# EAGLE board NeoPixel_HD_rev0 (EAGLE 7.2.0), part 1 of 2
REV: B
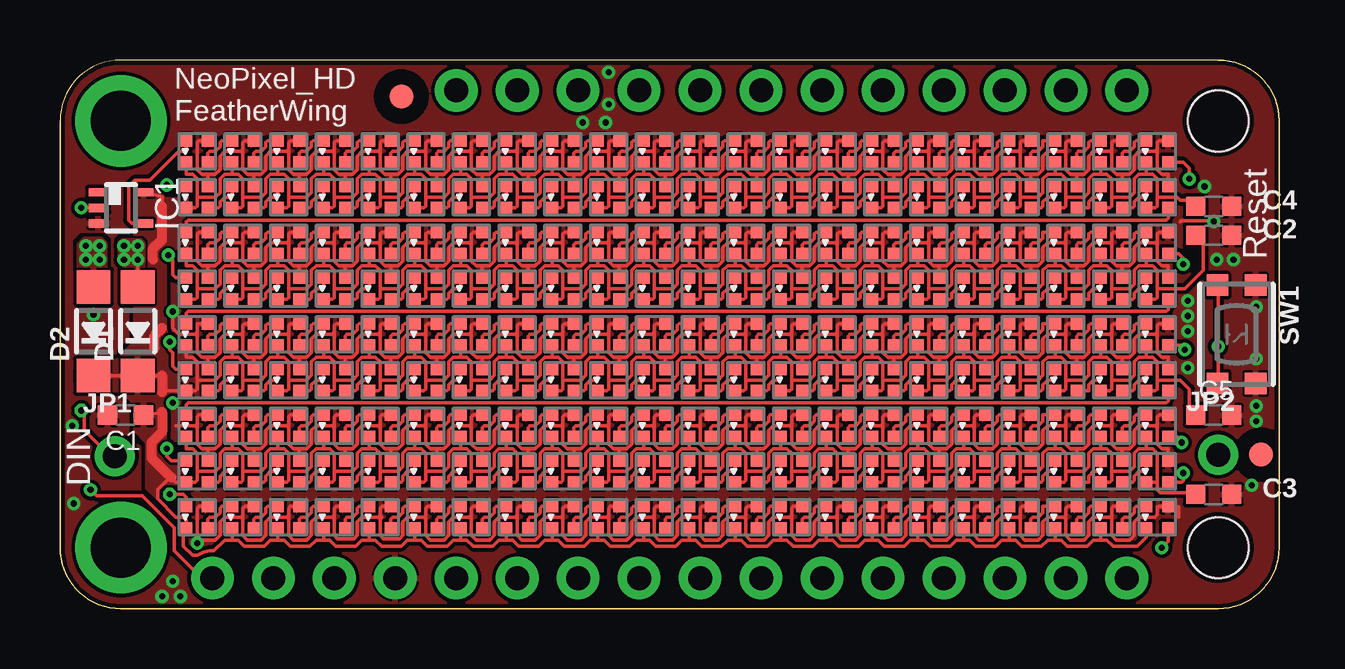
[diagram p2: board, top side]
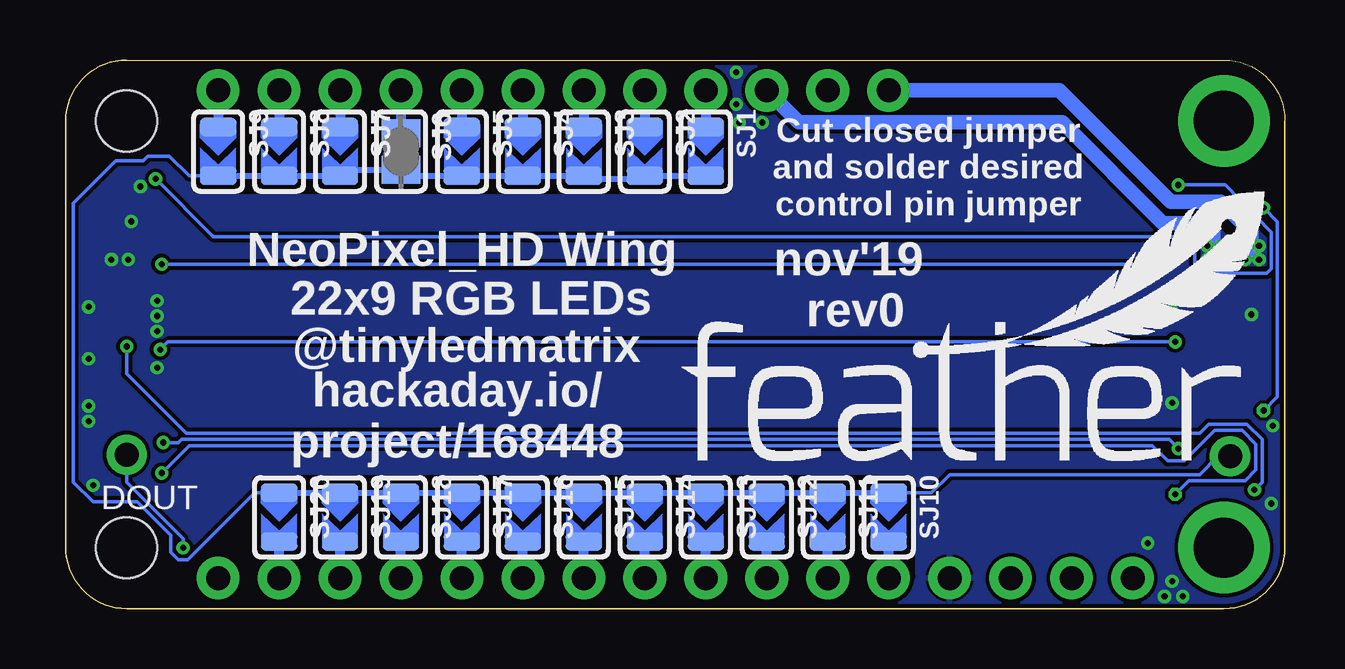
[diagram p3: board, bottom side, seen from below]

Size 50.8 x 22.86 mm. Coordinates in mm from the lower left corner, seen from the top.
Outline: 48.26,22.86 arc-90 50.8,20.32 50.8,2.54 arc-90 48.26,0 2.54,0 arc-90 0,2.54 0,20.32
Copper layers (1*16): Top 0.035mm / dielectric 1.5mm / Bottom 0.035mm
Design rules "aisler_2_layer *": minimum track width 0.1mm, minimum drill 0.2mm, track to track 0.1mm, track to pad 0.1mm, pad to pad 0.1mm, via to via 0.1mm, smd to smd 0.1mm, copper to edge 0.2mm, drill to drill 0.21mm, minimum pad ring 0.25mm, minimum via ring 0.15mm, stop-mask expansion 0mil, vias tented up to drill 10mil, thermal gap 0.1mm
bRestrict: area 17.5,3.2 to 18,3.3; 6 lines

## Footprints (pad centres in the part's own frame; a part is rotated, then mirrored left to right if it is on the bottom)
C0603-VISHAY = smd 0.8 x 0.8: 1 -0.75,0; 2 0.75,0
SOD-123 = smd 1.4 x 1.4: A 1.85,0; C -1.85,0
FIDUCIAL_1MM = smd 1 x 1: 1 0,0
DCK_R-PDSO-G5 = smd 0.35 x 0.8: 1 -0.65,-0.95; 2 0,-0.95; 3 0.65,-0.95; 4 0.65,0.95; 5 -0.65,0.95
1X01_ROUND = drill 1 pad 1.676: 1 0,0
LED1515 = smd 0.5 x 0.5: DIN 0.45,0.45; DOUT -0.45,-0.45; GND 0.45,-0.45; VDD -0.45,0.45
FEATHERWING = drill 1 pad 1.778: 1 6.35,1.27; 2 8.89,1.27; 3 11.43,1.27; 4 13.97,1.27; 5 16.51,1.27; 6 19.05,1.27; 7 21.59,1.27; 8 24.13,1.27; 9 26.67,1.27; 10 29.21,1.27; 11 31.75,1.27; 12 34.29,1.27; 13 36.83,1.27; 14 39.37,1.27; 15 41.91,1.27; 16 44.45,1.27; 17 44.45,21.59; 18 41.91,21.59; 19 39.37,21.59; 20 36.83,21.59; 21 34.29,21.59; 22 31.75,21.59; 23 29.21,21.59; 24 26.67,21.59; 25 24.13,21.59; 26 21.59,21.59; 27 19.05,21.59; 28 16.51,21.59 | drill 2.5 pad 3.81: P$1 2.54,20.32; P$2 2.54,2.54 | hole 2.54: 48.26,20.32; 48.26,2.54
SOLDERJUMPER_ARROW_NOPASTE = smd 0.762 x 1.524: 1 -1.016,0; 2 1.016,0
SOLDERJUMPER_CLOSEDWIRE = smd 1.168 x 1.6: 1 -0.762,0; 2 0.762,0 | smd 0.635 x 0.203: WIRE 0,0
BTN_KMR2_4.6X2.8 = smd 0.9 x 0.9: A 2.05,0.8; A' -2.05,0.8; B 2.05,-0.8; B' -2.05,-0.8

## Placement (x,y rotation side)
C1  10uF 10V X7R  [C0603-VISHAY]  2.73,8.06 180 top
C2  10uF  [C0603-VISHAY]  48.07,15.56 0 top
C3  10uF  [C0603-VISHAY]  48.07,4.76 0 top
C4  10uF  [C0603-VISHAY]  48.07,16.76 0 top
C5  10uF  [C0603-VISHAY]  48.07,8.06 0 top
D1  MBR120  [SOD-123]  3.24,11.56 90 top
D2  MBR120  [SOD-123]  1.4,11.56 90 top
FID1  FIDUCIAL""  [FIDUCIAL_1MM]  14.22,21.34 0 top
FID2  FIDUCIAL""  [FIDUCIAL_1MM]  50.04,6.41 0 top
IC1  SN74LV1T34  [DCK_R-PDSO-G5]  2.54,16.7 270 top
JP1  [1X01_ROUND]  2.29,6.35 0 top
JP2  [1X01_ROUND]  48.26,6.41 0 top
LED1  WS2812B1515  [LED1515]  5.71,19.05 90 top
LED2  WS2812B1515  [LED1515]  7.62,19.05 90 top
LED3  WS2812B1515  [LED1515]  9.53,19.05 90 top
LED4  WS2812B1515  [LED1515]  11.43,19.05 90 top
LED5  WS2812B1515  [LED1515]  13.34,19.05 90 top
LED6  WS2812B1515  [LED1515]  15.24,19.05 90 top
LED7  WS2812B1515  [LED1515]  17.14,19.05 90 top
LED8  WS2812B1515  [LED1515]  19.05,19.05 90 top
LED9  WS2812B1515  [LED1515]  20.95,19.05 90 top
LED10  WS2812B1515  [LED1515]  22.86,19.05 90 top
LED11  WS2812B1515  [LED1515]  24.77,19.05 90 top
LED12  WS2812B1515  [LED1515]  26.67,19.05 90 top
LED13  WS2812B1515  [LED1515]  28.57,19.05 90 top
LED14  WS2812B1515  [LED1515]  30.48,19.05 90 top
LED15  WS2812B1515  [LED1515]  32.38,19.05 90 top
LED16  WS2812B1515  [LED1515]  34.29,19.05 90 top
LED17  WS2812B1515  [LED1515]  36.2,19.05 90 top
LED18  WS2812B1515  [LED1515]  38.1,19.05 90 top
LED19  WS2812B1515  [LED1515]  40.01,19.05 90 top
LED20  WS2812B1515  [LED1515]  41.91,19.05 90 top
LED21  WS2812B1515  [LED1515]  43.81,19.05 90 top
LED22  WS2812B1515  [LED1515]  45.72,19.05 90 top
LED23  WS2812B1515  [LED1515]  5.71,17.14 90 top
LED24  WS2812B1515  [LED1515]  7.62,17.14 90 top
LED25  WS2812B1515  [LED1515]  9.53,17.14 90 top
LED26  WS2812B1515  [LED1515]  11.43,17.14 90 top
LED27  WS2812B1515  [LED1515]  13.34,17.14 90 top
LED28  WS2812B1515  [LED1515]  15.24,17.14 90 top
LED29  WS2812B1515  [LED1515]  17.14,17.14 90 top
LED30  WS2812B1515  [LED1515]  19.05,17.14 90 top
LED31  WS2812B1515  [LED1515]  20.95,17.14 90 top
LED32  WS2812B1515  [LED1515]  22.86,17.14 90 top
LED33  WS2812B1515  [LED1515]  24.77,17.14 90 top
LED34  WS2812B1515  [LED1515]  26.67,17.14 90 top
LED35  WS2812B1515  [LED1515]  28.57,17.14 90 top
LED36  WS2812B1515  [LED1515]  30.48,17.14 90 top
LED37  WS2812B1515  [LED1515]  32.38,17.14 90 top
LED38  WS2812B1515  [LED1515]  34.29,17.14 90 top
LED39  WS2812B1515  [LED1515]  36.2,17.14 90 top
LED40  WS2812B1515  [LED1515]  38.1,17.14 90 top
LED41  WS2812B1515  [LED1515]  40.01,17.14 90 top
LED42  WS2812B1515  [LED1515]  41.91,17.14 90 top
LED43  WS2812B1515  [LED1515]  43.81,17.14 90 top
LED44  WS2812B1515  [LED1515]  45.72,17.14 90 top
LED45  WS2812B1515  [LED1515]  5.71,15.24 90 top
LED46  WS2812B1515  [LED1515]  7.62,15.24 90 top
LED47  WS2812B1515  [LED1515]  9.53,15.24 90 top
LED48  WS2812B1515  [LED1515]  11.43,15.24 90 top
LED49  WS2812B1515  [LED1515]  13.34,15.24 90 top
LED50  WS2812B1515  [LED1515]  15.24,15.24 90 top
LED51  WS2812B1515  [LED1515]  17.14,15.24 90 top
LED52  WS2812B1515  [LED1515]  19.05,15.24 90 top
LED53  WS2812B1515  [LED1515]  20.95,15.24 90 top
LED54  WS2812B1515  [LED1515]  22.86,15.24 90 top
LED55  WS2812B1515  [LED1515]  24.77,15.24 90 top
LED56  WS2812B1515  [LED1515]  26.67,15.24 90 top
LED57  WS2812B1515  [LED1515]  28.57,15.24 90 top
LED58  WS2812B1515  [LED1515]  30.48,15.24 90 top
LED59  WS2812B1515  [LED1515]  32.38,15.24 90 top
LED60  WS2812B1515  [LED1515]  34.29,15.24 90 top
LED61  WS2812B1515  [LED1515]  36.2,15.24 90 top
LED62  WS2812B1515  [LED1515]  38.1,15.24 90 top
LED63  WS2812B1515  [LED1515]  40.01,15.24 90 top
LED64  WS2812B1515  [LED1515]  41.91,15.24 90 top
LED65  WS2812B1515  [LED1515]  43.81,15.24 90 top
LED66  WS2812B1515  [LED1515]  45.72,15.24 90 top
LED67  WS2812B1515  [LED1515]  5.71,13.34 90 top
LED68  WS2812B1515  [LED1515]  7.62,13.34 90 top
LED69  WS2812B1515  [LED1515]  9.53,13.34 90 top
LED70  WS2812B1515  [LED1515]  11.43,13.34 90 top
LED71  WS2812B1515  [LED1515]  13.34,13.34 90 top
LED72  WS2812B1515  [LED1515]  15.24,13.34 90 top
LED73  WS2812B1515  [LED1515]  17.14,13.34 90 top
LED74  WS2812B1515  [LED1515]  19.05,13.34 90 top
LED75  WS2812B1515  [LED1515]  20.95,13.34 90 top
LED76  WS2812B1515  [LED1515]  22.86,13.34 90 top
LED77  WS2812B1515  [LED1515]  24.77,13.34 90 top
LED78  WS2812B1515  [LED1515]  26.67,13.34 90 top
LED79  WS2812B1515  [LED1515]  28.57,13.34 90 top
LED80  WS2812B1515  [LED1515]  30.48,13.34 90 top
LED81  WS2812B1515  [LED1515]  32.38,13.34 90 top
LED82  WS2812B1515  [LED1515]  34.29,13.34 90 top
LED83  WS2812B1515  [LED1515]  36.2,13.34 90 top
LED84  WS2812B1515  [LED1515]  38.1,13.34 90 top
LED85  WS2812B1515  [LED1515]  40.01,13.34 90 top
LED86  WS2812B1515  [LED1515]  41.91,13.34 90 top
LED87  WS2812B1515  [LED1515]  43.81,13.34 90 top
LED88  WS2812B1515  [LED1515]  45.72,13.34 90 top
LED89  WS2812B1515  [LED1515]  5.71,11.43 90 top
LED90  WS2812B1515  [LED1515]  7.62,11.43 90 top
LED91  WS2812B1515  [LED1515]  9.53,11.43 90 top
LED92  WS2812B1515  [LED1515]  11.43,11.43 90 top
LED93  WS2812B1515  [LED1515]  13.34,11.43 90 top
LED94  WS2812B1515  [LED1515]  15.24,11.43 90 top
LED95  WS2812B1515  [LED1515]  17.14,11.43 90 top
LED96  WS2812B1515  [LED1515]  19.05,11.43 90 top
LED97  WS2812B1515  [LED1515]  20.95,11.43 90 top
LED98  WS2812B1515  [LED1515]  22.86,11.43 90 top
LED99  WS2812B1515  [LED1515]  24.77,11.43 90 top
LED100  WS2812B1515  [LED1515]  26.67,11.43 90 top
LED101  WS2812B1515  [LED1515]  28.57,11.43 90 top
LED102  WS2812B1515  [LED1515]  30.48,11.43 90 top
LED103  WS2812B1515  [LED1515]  32.38,11.43 90 top
LED104  WS2812B1515  [LED1515]  34.29,11.43 90 top
LED105  WS2812B1515  [LED1515]  36.2,11.43 90 top
LED106  WS2812B1515  [LED1515]  38.1,11.43 90 top
LED107  WS2812B1515  [LED1515]  40.01,11.43 90 top
LED108  WS2812B1515  [LED1515]  41.91,11.43 90 top
LED109  WS2812B1515  [LED1515]  43.81,11.43 90 top
LED110  WS2812B1515  [LED1515]  45.72,11.43 90 top
LED111  WS2812B1515  [LED1515]  5.71,9.53 90 top
LED112  WS2812B1515  [LED1515]  7.62,9.53 90 top
LED113  WS2812B1515  [LED1515]  9.53,9.53 90 top
LED114  WS2812B1515  [LED1515]  11.43,9.53 90 top
LED115  WS2812B1515  [LED1515]  13.34,9.53 90 top
LED116  WS2812B1515  [LED1515]  15.24,9.53 90 top
LED117  WS2812B1515  [LED1515]  17.14,9.53 90 top
LED118  WS2812B1515  [LED1515]  19.05,9.53 90 top
LED119  WS2812B1515  [LED1515]  20.95,9.53 90 top
LED120  WS2812B1515  [LED1515]  22.86,9.53 90 top
LED121  WS2812B1515  [LED1515]  24.77,9.53 90 top
LED122  WS2812B1515  [LED1515]  26.67,9.53 90 top
LED123  WS2812B1515  [LED1515]  28.57,9.53 90 top
LED124  WS2812B1515  [LED1515]  30.48,9.53 90 top
LED125  WS2812B1515  [LED1515]  32.38,9.53 90 top
LED126  WS2812B1515  [LED1515]  34.29,9.53 90 top
LED127  WS2812B1515  [LED1515]  36.2,9.53 90 top
LED128  WS2812B1515  [LED1515]  38.1,9.53 90 top
LED129  WS2812B1515  [LED1515]  40.01,9.53 90 top
LED130  WS2812B1515  [LED1515]  41.91,9.53 90 top
LED131  WS2812B1515  [LED1515]  43.81,9.53 90 top
LED132  WS2812B1515  [LED1515]  45.72,9.53 90 top
LED133  WS2812B1515  [LED1515]  5.71,7.62 90 top
LED134  WS2812B1515  [LED1515]  7.62,7.62 90 top
LED135  WS2812B1515  [LED1515]  9.53,7.62 90 top
LED136  WS2812B1515  [LED1515]  11.43,7.62 90 top
LED137  WS2812B1515  [LED1515]  13.34,7.62 90 top
LED138  WS2812B1515  [LED1515]  15.24,7.62 90 top
LED139  WS2812B1515  [LED1515]  17.14,7.62 90 top
LED140  WS2812B1515  [LED1515]  19.05,7.62 90 top
LED141  WS2812B1515  [LED1515]  20.95,7.62 90 top
LED142  WS2812B1515  [LED1515]  22.86,7.62 90 top
LED143  WS2812B1515  [LED1515]  24.77,7.62 90 top
LED144  WS2812B1515  [LED1515]  26.67,7.62 90 top
LED145  WS2812B1515  [LED1515]  28.57,7.62 90 top
LED146  WS2812B1515  [LED1515]  30.48,7.62 90 top
LED147  WS2812B1515  [LED1515]  32.38,7.62 90 top
LED148  WS2812B1515  [LED1515]  34.29,7.62 90 top
LED149  WS2812B1515  [LED1515]  36.2,7.62 90 top
LED150  WS2812B1515  [LED1515]  38.1,7.62 90 top
LED151  WS2812B1515  [LED1515]  40.01,7.62 90 top
LED152  WS2812B1515  [LED1515]  41.91,7.62 90 top
LED153  WS2812B1515  [LED1515]  43.81,7.62 90 top
LED154  WS2812B1515  [LED1515]  45.72,7.62 90 top
LED155  WS2812B1515  [LED1515]  5.71,5.71 90 top
LED156  WS2812B1515  [LED1515]  7.62,5.71 90 top
LED157  WS2812B1515  [LED1515]  9.53,5.71 90 top
LED158  WS2812B1515  [LED1515]  11.43,5.71 90 top
LED159  WS2812B1515  [LED1515]  13.34,5.71 90 top
LED160  WS2812B1515  [LED1515]  15.24,5.71 90 top
LED161  WS2812B1515  [LED1515]  17.14,5.71 90 top
LED162  WS2812B1515  [LED1515]  19.05,5.71 90 top
LED163  WS2812B1515  [LED1515]  20.95,5.71 90 top
LED164  WS2812B1515  [LED1515]  22.86,5.71 90 top
LED165  WS2812B1515  [LED1515]  24.77,5.71 90 top
LED166  WS2812B1515  [LED1515]  26.67,5.71 90 top
LED167  WS2812B1515  [LED1515]  28.57,5.71 90 top
LED168  WS2812B1515  [LED1515]  30.48,5.71 90 top
LED169  WS2812B1515  [LED1515]  32.38,5.71 90 top
LED170  WS2812B1515  [LED1515]  34.29,5.71 90 top
LED171  WS2812B1515  [LED1515]  36.2,5.71 90 top
LED172  WS2812B1515  [LED1515]  38.1,5.71 90 top
LED173  WS2812B1515  [LED1515]  40.01,5.71 90 top
LED174  WS2812B1515  [LED1515]  41.91,5.71 90 top
LED175  WS2812B1515  [LED1515]  43.81,5.71 90 top
LED176  WS2812B1515  [LED1515]  45.72,5.71 90 top
LED177  WS2812B1515  [LED1515]  5.71,3.81 90 top
LED178  WS2812B1515  [LED1515]  7.62,3.81 90 top
LED179  WS2812B1515  [LED1515]  9.53,3.81 90 top
LED180  WS2812B1515  [LED1515]  11.43,3.81 90 top
LED181  WS2812B1515  [LED1515]  13.34,3.81 90 top
LED182  WS2812B1515  [LED1515]  15.24,3.81 90 top
LED183  WS2812B1515  [LED1515]  17.14,3.81 90 top
LED184  WS2812B1515  [LED1515]  19.05,3.81 90 top
LED185  WS2812B1515  [LED1515]  20.95,3.81 90 top
LED186  WS2812B1515  [LED1515]  22.86,3.81 90 top
LED187  WS2812B1515  [LED1515]  24.77,3.81 90 top
LED188  WS2812B1515  [LED1515]  26.67,3.81 90 top
LED189  WS2812B1515  [LED1515]  28.57,3.81 90 top
LED190  WS2812B1515  [LED1515]  30.48,3.81 90 top
LED191  WS2812B1515  [LED1515]  32.38,3.81 90 top
LED192  WS2812B1515  [LED1515]  34.29,3.81 90 top
LED193  WS2812B1515  [LED1515]  36.2,3.81 90 top
LED194  WS2812B1515  [LED1515]  38.1,3.81 90 top
LED195  WS2812B1515  [LED1515]  40.01,3.81 90 top
LED196  WS2812B1515  [LED1515]  41.91,3.81 90 top
LED197  WS2812B1515  [LED1515]  43.81,3.81 90 top
LED198  WS2812B1515  [LED1515]  45.72,3.81 90 top
MS1  FEATHERWING  [FEATHERWING]  0,0 0 top
SJ1  [SOLDERJUMPER_ARROW_NOPASTE]  24.13,19.05 270 bottom
SJ2  [SOLDERJUMPER_ARROW_NOPASTE]  26.67,19.05 270 bottom
SJ3  [SOLDERJUMPER_ARROW_NOPASTE]  29.21,19.05 270 bottom
SJ4  [SOLDERJUMPER_ARROW_NOPASTE]  31.75,19.05 270 bottom
SJ5  [SOLDERJUMPER_ARROW_NOPASTE]  34.29,19.05 270 bottom
SJ6  [SOLDERJUMPER_CLOSEDWIRE]  36.83,19.05 270 bottom
SJ7  [SOLDERJUMPER_ARROW_NOPASTE]  39.37,19.05 270 bottom
SJ8  [SOLDERJUMPER_ARROW_NOPASTE]  41.91,19.05 270 bottom
SJ9  [SOLDERJUMPER_ARROW_NOPASTE]  44.45,19.05 270 bottom
SJ10  [SOLDERJUMPER_ARROW_NOPASTE]  16.51,3.81 270 bottom
SJ11  [SOLDERJUMPER_ARROW_NOPASTE]  19.05,3.81 270 bottom
SJ12  [SOLDERJUMPER_ARROW_NOPASTE]  21.59,3.81 270 bottom
SJ13  [SOLDERJUMPER_ARROW_NOPASTE]  24.13,3.81 270 bottom
SJ14  [SOLDERJUMPER_ARROW_NOPASTE]  26.67,3.81 270 bottom
SJ15  [SOLDERJUMPER_ARROW_NOPASTE]  29.21,3.81 270 bottom
SJ16  [SOLDERJUMPER_ARROW_NOPASTE]  31.75,3.81 270 bottom
SJ17  [SOLDERJUMPER_ARROW_NOPASTE]  34.29,3.81 270 bottom
SJ18  [SOLDERJUMPER_ARROW_NOPASTE]  36.83,3.81 270 bottom
SJ19  [SOLDERJUMPER_ARROW_NOPASTE]  39.37,3.81 270 bottom
SJ20  [SOLDERJUMPER_ARROW_NOPASTE]  41.91,3.81 270 bottom
SW1  KMR2  [BTN_KMR2_4.6X2.8]  49.02,11.43 270 top
U$3  [FEATHERLOGO]  25.15,6.1 0 bottom

## Tracks (layer width: path | path; a pad name or v marks a point on that pad's centre or on a via)
D6
  Bottom 0.406: MS1.20 SJ6.1
DIN  (via drill 0.25 pad 0.51)
  Top 0.152: IC1.2 v0.89,16.7 | v0.89,8.26 1.02,8.13 1.02,7.43 2.1,6.35 JP1.1
  Bottom 0.152: SJ9.2 45.66,18.03 46.48,18.86 47.37,18.86 47.56,18.67 48.7,18.67 50.48,16.89 50.48,5.27 49.66,4.45 47.82,4.45 46.42,3.05 46.42,2.35 46.1,2.03 45.72,2.03 42.93,4.83 SJ20.1 | JP1.1 2.79,6.35 3.56,5.59 13.97,5.59 14.73,4.83 SJ10.1 | v0.89,8.26 0.32,8.83 0.32,16.13 v0.89,16.7
  Bottom 0.254: SJ10.1 SJ11.1 SJ12.1 SJ13.1 SJ14.1 SJ15.1 SJ16.1 SJ17.1 SJ18.1 SJ19.1 SJ20.1 42.16,4.83 | SJ1.2 SJ2.2 26.29,18.03 26.16,17.91 29.08,17.91 SJ3.2 SJ4.2 SJ5.2 36.58,18.03 SJ6.2 39.12,18.29 SJ7.2 SJ8.2 SJ9.2 43.31,18.03
GND  (via drill 0.25 pad 0.51)
  Top 0.152: LED23.GND 6.17,18.1 | 6.17,18.1 5.91,18.1 5.71,18.29 5.71,19.42 5.79,19.5 LED1.GND | LED24.GND 8.07,18.1 | 8.07,18.1 7.81,18.1 7.62,18.29 7.62,19.05 | 7.62,19.05 6.86,19.05 6.67,18.86 6.67,18.29 6.48,18.1 6.17,18.1 | LED25.GND 9.97,18.1 | 9.97,18.1 9.72,18.1 9.53,18.29 9.53,19.05 | 9.53,19.05 8.76,19.05 8.57,18.86 8.57,18.29 8.38,18.1 8.07,18.1 | LED26.GND 11.88,18.1 | 11.88,18.1 11.62,18.1 11.43,18.29 11.43,19.05 | 11.43,19.05 10.67,19.05 10.48,18.86 10.48,18.29 10.29,18.1 9.97,18.1 | LED27.GND 13.79,18.1 | 13.79,18.1 13.53,18.1 13.34,18.29 13.34,19.05 | 13.34,19.05 12.57,19.05 12.38,18.86 12.38,18.29 12.19,18.1 11.88,18.1 | LED28.GND 15.69,18.1 | 15.69,18.1 15.43,18.1 15.24,18.29 15.24,19.05 | 15.24,19.05 14.48,19.05 14.29,18.86 14.29,18.29 14.1,18.1 13.79,18.1 | LED29.GND 17.59,18.1 | 17.59,18.1 17.34,18.1 17.14,18.29 17.14,19.05 | 17.14,19.05 16.38,19.05 16.19,18.86 16.19,18.29 16,18.1 15.69,18.1 | LED30.GND 19.5,18.1 | 19.5,18.1 19.24,18.1 19.05,18.29 19.05,19.05 | 19.05,19.05 18.29,19.05 18.1,18.86 18.1,18.29 17.91,18.1 17.59,18.1 | LED31.GND 21.41,18.1 | 21.41,18.1 21.14,18.1 20.95,18.29 20.95,19.05 | 20.95,19.05 20.19,19.05 20,18.86 20,18.29 19.81,18.1 19.5,18.1 | LED32.GND 23.31,18.1 | 23.31,18.1 23.05,18.1 22.86,18.29 22.86,19.05 | 22.86,19.05 22.1,19.05 21.91,18.86 21.91,18.29 21.72,18.1 21.41,18.1 | LED33.GND 25.21,18.1 | 25.21,18.1 24.96,18.1 24.77,18.29 24.77,19.05 | 24.77,19.05 24,19.05 23.81,18.86 23.81,18.29 23.62,18.1 23.31,18.1 | LED34.GND 27.12,18.1 | 27.12,18.1 26.86,18.1 26.67,18.29 26.67,19.05 | 26.67,19.05 25.91,19.05 25.72,18.86 25.72,18.29 25.53,18.1 25.21,18.1
  Top 0.152: LED35.GND 29.02,18.1 | 29.02,18.1 28.77,18.1 28.57,18.29 28.57,19.05 | 28.57,19.05 27.81,19.05 27.62,18.86 27.62,18.29 27.43,18.1 27.12,18.1 | LED36.GND 30.93,18.1 | 30.93,18.1 30.67,18.1 30.48,18.29 30.48,19.05 | 30.48,19.05 29.72,19.05 29.53,18.86 29.53,18.29 29.34,18.1 29.02,18.1 | LED37.GND 32.84,18.1 | 32.84,18.1 32.58,18.1 32.38,18.29 32.38,19.05 | 32.38,19.05 31.62,19.05 31.43,18.86 31.43,18.29 31.24,18.1 30.93,18.1 | LED38.GND 34.74,18.1 | 34.74,18.1 34.48,18.1 34.29,18.29 34.29,19.05 | 34.29,19.05 33.53,19.05 33.34,18.86 33.34,18.29 33.15,18.1 32.84,18.1 | LED39.GND 36.65,18.1 | 36.65,18.1 36.39,18.1 36.2,18.29 36.2,19.05 | 36.2,19.05 35.43,19.05 35.24,18.86 35.24,18.29 35.05,18.1 34.74,18.1 | LED40.GND 38.55,18.1 | 38.55,18.1 38.29,18.1 38.1,18.29 38.1,19.05 | 38.1,19.05 37.34,19.05 37.15,18.86 37.15,18.29 36.96,18.1 36.65,18.1 | LED41.GND 40.45,18.1 | 40.45,18.1 40.2,18.1 40.01,18.29 40.01,19.05 | 40.01,19.05 39.24,19.05 39.05,18.86 39.05,18.29 38.86,18.1 38.55,18.1 | LED42.GND 42.36,18.1 | 42.36,18.1 42.1,18.1 41.91,18.29 41.91,19.05 | 41.91,19.05 41.15,19.05 40.96,18.86 40.96,18.29 40.77,18.1 40.45,18.1 | LED43.GND 44.27,18.1 | 44.27,18.1 44.01,18.1 43.81,18.29 43.81,19.05 | 43.81,19.05 43.05,19.05 42.86,18.86 42.86,18.29 42.67,18.1 42.36,18.1 | LED44.GND 46.17,18.1 45.91,18.1 45.72,18.29 45.72,19.05 | 45.72,19.05 44.96,19.05 44.77,18.86 44.77,18.29 44.58,18.1 44.27,18.1 | LED22.GND 45.8,19.5 45.72,19.42 45.72,19.05 | LED21.GND 43.89,19.5 43.81,19.42 43.81,19.05 | LED20.GND 41.99,19.5 41.91,19.42 41.91,19.05 | LED19.GND 40.08,19.5 40.01,19.42 40.01,19.05 | LED18.GND 38.18,19.5 38.1,19.42 38.1,19.05
  Top 0.152: LED17.GND 36.27,19.5 36.2,19.42 36.2,19.05 | LED16.GND 34.37,19.5 34.29,19.42 34.29,19.05 | LED15.GND 32.46,19.5 32.38,19.42 32.38,19.05 | LED14.GND 30.56,19.5 30.48,19.42 30.48,19.05 | LED13.GND 28.65,19.5 28.57,19.42 28.57,19.05 | LED12.GND 26.75,19.5 26.67,19.42 26.67,19.05 | LED11.GND 24.84,19.5 24.77,19.42 24.77,19.05 | LED10.GND 22.94,19.5 22.86,19.42 22.86,19.05 | LED9.GND 21.03,19.5 20.95,19.42 20.95,19.05 | LED8.GND 19.13,19.5 19.05,19.42 19.05,19.05 | LED7.GND 17.22,19.5 17.14,19.42 17.14,19.05 | LED6.GND 15.32,19.5 15.24,19.42 15.24,19.05 | LED5.GND 13.41,19.5 13.34,19.42 13.34,19.05 | LED4.GND 11.51,19.5 11.43,19.42 11.43,19.05 | 9.53,19.05 9.53,19.42 9.6,19.5 LED3.GND | 7.62,19.05 7.62,19.42 7.7,19.5 LED2.GND | LED67.GND 6.17,14.29 | 6.17,14.29 5.91,14.29 5.71,14.48 5.71,15.61 5.79,15.69 LED45.GND | LED68.GND 8.07,14.29 | 8.07,14.29 7.81,14.29 7.62,14.48 7.62,15.24 | 7.62,15.24 6.86,15.24 6.67,15.05 6.67,14.48 6.48,14.29 6.17,14.29 | LED69.GND 9.97,14.29 | 9.97,14.29 9.72,14.29 9.53,14.48 9.53,15.24 | 9.53,15.24 8.76,15.24 8.57,15.05 8.57,14.48 8.38,14.29 8.07,14.29 | LED70.GND 11.88,14.29 | 11.88,14.29 11.62,14.29 11.43,14.48 11.43,15.24 | 11.43,15.24 10.67,15.24 10.48,15.05 10.48,14.48 10.29,14.29 9.97,14.29 | LED71.GND 13.79,14.29 | 13.79,14.29 13.53,14.29 13.34,14.48 13.34,15.24 | 13.34,15.24 12.57,15.24 12.38,15.05 12.38,14.48 12.19,14.29 11.88,14.29 | LED72.GND 15.69,14.29 | 15.69,14.29 15.43,14.29 15.24,14.48 15.24,15.24 | 15.24,15.24 14.48,15.24 14.29,15.05 14.29,14.48 14.1,14.29 13.79,14.29 | LED73.GND 17.59,14.29 | 17.59,14.29 17.34,14.29 17.14,14.48 17.14,15.24
  Top 0.152: 17.14,15.24 16.38,15.24 16.19,15.05 16.19,14.48 16,14.29 15.69,14.29 | LED74.GND 19.5,14.29 | 19.5,14.29 19.24,14.29 19.05,14.48 19.05,15.24 | 19.05,15.24 18.29,15.24 18.1,15.05 18.1,14.48 17.91,14.29 17.59,14.29 | LED75.GND 21.41,14.29 | 21.41,14.29 21.14,14.29 20.95,14.48 20.95,15.24 | 20.95,15.24 20.19,15.24 20,15.05 20,14.48 19.81,14.29 19.5,14.29 | LED76.GND 23.31,14.29 | 23.31,14.29 23.05,14.29 22.86,14.48 22.86,15.24 | 22.86,15.24 22.1,15.24 21.91,15.05 21.91,14.48 21.72,14.29 21.41,14.29 | LED77.GND 25.21,14.29 | 25.21,14.29 24.96,14.29 24.77,14.48 24.77,15.24 | 24.77,15.24 24,15.24 23.81,15.05 23.81,14.48 23.62,14.29 23.31,14.29 | LED78.GND 27.12,14.29 | 27.12,14.29 26.86,14.29 26.67,14.48 26.67,15.24 | 26.67,15.24 25.91,15.24 25.72,15.05 25.72,14.48 25.53,14.29 25.21,14.29 | LED79.GND 29.02,14.29 | 29.02,14.29 28.77,14.29 28.57,14.48 28.57,15.24 | 28.57,15.24 27.81,15.24 27.62,15.05 27.62,14.48 27.43,14.29 27.12,14.29 | LED80.GND 30.93,14.29 | 30.93,14.29 30.67,14.29 30.48,14.48 30.48,15.24 | 30.48,15.24 29.72,15.24 29.53,15.05 29.53,14.48 29.34,14.29 29.02,14.29 | LED81.GND 32.84,14.29 | 32.84,14.29 32.58,14.29 32.38,14.48 32.38,15.24 | 32.38,15.24 31.62,15.24 31.43,15.05 31.43,14.48 31.24,14.29 30.93,14.29 | LED82.GND 34.74,14.29 | 34.74,14.29 34.48,14.29 34.29,14.48 34.29,15.24 | 34.29,15.24 33.53,15.24 33.34,15.05 33.34,14.48 33.15,14.29 32.84,14.29 | LED83.GND 36.65,14.29 | 36.65,14.29 36.39,14.29 36.2,14.48 36.2,15.24 | 36.2,15.24 35.43,15.24 35.24,15.05 35.24,14.48 35.05,14.29 34.74,14.29 | LED84.GND 38.55,14.29 | 38.55,14.29 38.29,14.29 38.1,14.48 38.1,15.24
  Top 0.152: 38.1,15.24 37.34,15.24 37.15,15.05 37.15,14.48 36.96,14.29 36.65,14.29 | LED85.GND 40.45,14.29 | 40.45,14.29 40.2,14.29 40.01,14.48 40.01,15.24 | 40.01,15.24 39.24,15.24 39.05,15.05 39.05,14.48 38.86,14.29 38.55,14.29 | LED86.GND 42.36,14.29 | 42.36,14.29 42.1,14.29 41.91,14.48 41.91,15.24 | 41.91,15.24 41.15,15.24 40.96,15.05 40.96,14.48 40.77,14.29 40.45,14.29 | LED87.GND 44.27,14.29 | 44.27,14.29 44.01,14.29 43.81,14.48 43.81,15.24 | 43.81,15.24 43.05,15.24 42.86,15.05 42.86,14.48 42.67,14.29 42.36,14.29 | LED88.GND 46.17,14.29 45.91,14.29 45.72,14.48 45.72,15.24 | 45.72,15.24 44.96,15.24 44.77,15.05 44.77,14.48 44.58,14.29 44.27,14.29 | LED66.GND 45.8,15.69 45.72,15.61 45.72,15.24 | LED65.GND 43.89,15.69 43.81,15.61 43.81,15.24 | LED64.GND 41.99,15.69 41.91,15.61 41.91,15.24 | LED63.GND 40.08,15.69 40.01,15.61 40.01,15.24 | LED62.GND 38.18,15.69 38.1,15.61 38.1,15.24 | LED61.GND 36.27,15.69 36.2,15.61 36.2,15.24 | LED60.GND 34.37,15.69 34.29,15.61 34.29,15.24 | LED59.GND 32.46,15.69 32.38,15.61 32.38,15.24 | LED58.GND 30.56,15.69 30.48,15.61 30.48,15.24 | LED57.GND 28.65,15.69 28.57,15.61 28.57,15.24 | LED56.GND 26.75,15.69 26.67,15.61 26.67,15.24 | LED55.GND 24.84,15.69 24.77,15.61 24.77,15.24 | LED54.GND 22.94,15.69 22.86,15.61 22.86,15.24 | LED53.GND 21.03,15.69 20.95,15.61 20.95,15.24 | LED52.GND 19.13,15.69 19.05,15.61 19.05,15.24 | LED51.GND 17.22,15.69 17.14,15.61 17.14,15.24 | LED50.GND 15.32,15.69 15.24,15.61 15.24,15.24 | LED49.GND 13.41,15.69 13.34,15.61 13.34,15.24 | LED48.GND 11.51,15.69 11.43,15.61 11.43,15.24 | 9.53,15.24 9.53,15.61 9.6,15.69 LED47.GND
  Top 0.152: 7.62,15.24 7.62,15.61 7.7,15.69 LED46.GND | LED111.GND 6.17,10.48 | 6.17,10.48 5.91,10.48 5.71,10.67 5.71,11.43 | 5.71,11.8 5.79,11.88 LED89.GND 5.71,11.88 5.71,11.43 | LED112.GND 8.07,10.48 | 8.07,10.48 7.81,10.48 7.62,10.67 7.62,11.43 | 7.62,11.43 6.86,11.43 6.67,11.24 6.67,10.67 6.48,10.48 6.17,10.48 | LED113.GND 9.97,10.48 | 9.97,10.48 9.72,10.48 9.53,10.67 9.53,11.43 | 9.53,11.43 8.76,11.43 8.57,11.24 8.57,10.67 8.38,10.48 8.07,10.48 | LED114.GND 11.88,10.48 | 11.88,10.48 11.62,10.48 11.43,10.67 11.43,11.43 | 11.43,11.43 10.67,11.43 10.48,11.24 10.48,10.67 10.29,10.48 9.97,10.48 | LED115.GND 13.79,10.48 | 13.79,10.48 13.53,10.48 13.34,10.67 13.34,11.43 | 13.34,11.43 12.57,11.43 12.38,11.24 12.38,10.67 12.19,10.48 11.88,10.48 | LED116.GND 15.69,10.48 | 15.69,10.48 15.43,10.48 15.24,10.67 15.24,11.43 | 15.24,11.43 14.48,11.43 14.29,11.24 14.29,10.67 14.1,10.48 13.79,10.48 | LED117.GND 17.59,10.48 | 17.59,10.48 17.34,10.48 17.14,10.67 17.14,11.43 | 17.14,11.43 16.38,11.43 16.19,11.24 16.19,10.67 16,10.48 15.69,10.48 | LED118.GND 19.5,10.48 | 19.5,10.48 19.24,10.48 19.05,10.67 19.05,11.43 | 19.05,11.43 18.29,11.43 18.1,11.24 18.1,10.67 17.91,10.48 17.59,10.48 | LED119.GND 21.41,10.48 | 21.41,10.48 21.14,10.48 20.95,10.67 20.95,11.43 | 20.95,11.43 20.19,11.43 20,11.24 20,10.67 19.81,10.48 19.5,10.48 | LED120.GND 23.31,10.48 | 23.31,10.48 23.05,10.48 22.86,10.67 22.86,11.43 | 22.86,11.43 22.1,11.43 21.91,11.24 21.91,10.67 21.72,10.48 21.41,10.48 | LED121.GND 25.21,10.48 | 25.21,10.48 24.96,10.48 24.77,10.67 24.77,11.43 | 24.77,11.43 24,11.43 23.81,11.24 23.81,10.67 23.62,10.48 23.31,10.48
  Top 0.152: LED122.GND 27.12,10.48 | 27.12,10.48 26.86,10.48 26.67,10.67 26.67,11.43 | 26.67,11.43 25.91,11.43 25.72,11.24 25.72,10.67 25.53,10.48 25.21,10.48 | LED123.GND 29.02,10.48 | 29.02,10.48 28.77,10.48 28.57,10.67 28.57,11.43 | 28.57,11.43 27.81,11.43 27.62,11.24 27.62,10.67 27.43,10.48 27.12,10.48 | LED124.GND 30.93,10.48 | 30.93,10.48 30.67,10.48 30.48,10.67 30.48,11.43 | 30.48,11.43 29.72,11.43 29.53,11.24 29.53,10.67 29.34,10.48 29.02,10.48 | LED125.GND 32.84,10.48 | 32.84,10.48 32.58,10.48 32.38,10.67 32.38,11.43 | 32.38,11.43 31.62,11.43 31.43,11.24 31.43,10.67 31.24,10.48 30.93,10.48 | LED126.GND 34.74,10.48 | 34.74,10.48 34.48,10.48 34.29,10.67 34.29,11.43 | 34.29,11.43 33.53,11.43 33.34,11.24 33.34,10.67 33.15,10.48 32.84,10.48 | LED127.GND 36.65,10.48 | 36.65,10.48 36.39,10.48 36.2,10.67 36.2,11.43 | 36.2,11.43 35.43,11.43 35.24,11.24 35.24,10.67 35.05,10.48 34.74,10.48 | LED128.GND 38.55,10.48 | 38.55,10.48 38.29,10.48 38.1,10.67 38.1,11.43 | 38.1,11.43 37.34,11.43 37.15,11.24 37.15,10.67 36.96,10.48 36.65,10.48 | LED129.GND 40.45,10.48 | 40.45,10.48 40.2,10.48 40.01,10.67 40.01,11.43 | 40.01,11.43 39.24,11.43 39.05,11.24 39.05,10.67 38.86,10.48 38.55,10.48 | LED130.GND 42.36,10.48 | 42.36,10.48 42.1,10.48 41.91,10.67 41.91,11.43 | 41.91,11.43 41.15,11.43 40.96,11.24 40.96,10.67 40.77,10.48 40.45,10.48 | LED131.GND 44.27,10.48 | 44.27,10.48 44.01,10.48 43.81,10.67 43.81,11.43 | 43.81,11.43 43.05,11.43 42.86,11.24 42.86,10.67 42.67,10.48 42.36,10.48 | LED132.GND 46.17,10.48 45.91,10.48 45.72,10.67 45.72,11.43 | 45.72,11.43 44.96,11.43 44.77,11.24 44.77,10.67 44.58,10.48 44.27,10.48
  Top 0.152: LED110.GND 45.8,11.88 45.72,11.8 45.72,11.43 | LED109.GND 43.89,11.88 43.81,11.8 43.81,11.43 | LED108.GND 41.99,11.88 41.91,11.8 41.91,11.43 | LED107.GND 40.08,11.88 40.01,11.8 40.01,11.43 | LED106.GND 38.18,11.88 38.1,11.8 38.1,11.43 | LED105.GND 36.27,11.88 36.2,11.8 36.2,11.43 | LED104.GND 34.37,11.88 34.29,11.8 34.29,11.43 | LED103.GND 32.46,11.88 32.38,11.8 32.38,11.43 | LED102.GND 30.56,11.88 30.48,11.8 30.48,11.43 | LED101.GND 28.65,11.88 28.57,11.8 28.57,11.43 | LED100.GND 26.75,11.88 26.67,11.8 26.67,11.43 | LED99.GND 24.84,11.88 24.77,11.8 24.77,11.43 | LED98.GND 22.94,11.88 22.86,11.8 22.86,11.43 | LED97.GND 21.03,11.88 20.95,11.8 20.95,11.43 | LED96.GND 19.13,11.88 19.05,11.8 19.05,11.43 | LED95.GND 17.22,11.88 17.14,11.8 17.14,11.43 | LED94.GND 15.32,11.88 15.24,11.8 15.24,11.43 | LED93.GND 13.41,11.88 13.34,11.8 13.34,11.43 | LED92.GND 11.51,11.88 11.43,11.8 11.43,11.43 | 9.53,11.43 9.53,11.8 9.6,11.88 LED91.GND | 7.62,11.43 7.62,11.8 7.7,11.88 LED90.GND | LED155.GND 6.17,6.67 | 6.17,6.67 5.91,6.67 5.71,6.86 5.71,7.62 | 5.71,7.62 5.71,7.99 5.79,8.07 LED133.GND | LED156.GND 8.07,6.67 | 8.07,6.67 7.81,6.67 7.62,6.86 7.62,7.62 | 7.62,7.62 6.86,7.62 6.67,7.43 6.67,6.86 6.48,6.67 6.17,6.67 | LED157.GND 9.97,6.67 | 9.97,6.67 9.72,6.67 9.53,6.86 9.53,7.62 | 9.53,7.62 8.76,7.62 8.57,7.43 8.57,6.86 8.38,6.67 8.07,6.67 | LED158.GND 11.88,6.67 | 11.88,6.67 11.62,6.67 11.43,6.86 11.43,7.62 | 11.43,7.62 10.67,7.62 10.48,7.43 10.48,6.86 10.29,6.67 9.97,6.67 | LED159.GND 13.79,6.67 | 13.79,6.67 13.53,6.67 13.34,6.86 13.34,7.62 | 13.34,7.62 12.57,7.62 12.38,7.43 12.38,6.86 12.19,6.67 11.88,6.67
  Top 0.152: LED160.GND 15.69,6.67 | 15.69,6.67 15.43,6.67 15.24,6.86 15.24,7.62 | 15.24,7.62 14.48,7.62 14.29,7.43 14.29,6.86 14.1,6.67 13.79,6.67 | LED161.GND 17.59,6.67 | 17.59,6.67 17.34,6.67 17.14,6.86 17.14,7.62 | 17.14,7.62 16.38,7.62 16.19,7.43 16.19,6.86 16,6.67 15.69,6.67 | LED162.GND 19.5,6.67 | 19.5,6.67 19.24,6.67 19.05,6.86 19.05,7.62 | 19.05,7.62 18.29,7.62 18.1,7.43 18.1,6.86 17.91,6.67 17.59,6.67 | LED163.GND 21.41,6.67 | 21.41,6.67 21.14,6.67 20.95,6.86 20.95,7.62 | 20.95,7.62 20.19,7.62 20,7.43 20,6.86 19.81,6.67 19.5,6.67 | LED164.GND 23.31,6.67 | 23.31,6.67 23.05,6.67 22.86,6.86 22.86,7.62 | 22.86,7.62 22.1,7.62 21.91,7.43 21.91,6.86 21.72,6.67 21.41,6.67 | LED165.GND 25.21,6.67 | 25.21,6.67 24.96,6.67 24.77,6.86 24.77,7.62 | 24.77,7.62 24,7.62 23.81,7.43 23.81,6.86 23.62,6.67 23.31,6.67 | LED166.GND 27.12,6.67 | 27.12,6.67 26.86,6.67 26.67,6.86 26.67,7.62 | 26.67,7.62 25.91,7.62 25.72,7.43 25.72,6.86 25.53,6.67 25.21,6.67 | LED167.GND 29.02,6.67 | 29.02,6.67 28.77,6.67 28.57,6.86 28.57,7.62 | 28.57,7.62 27.81,7.62 27.62,7.43 27.62,6.86 27.43,6.67 27.12,6.67 | LED168.GND 30.93,6.67 | 30.93,6.67 30.67,6.67 30.48,6.86 30.48,7.62 | 30.48,7.62 29.72,7.62 29.53,7.43 29.53,6.86 29.34,6.67 29.02,6.67 | LED169.GND 32.84,6.67 | 32.84,6.67 32.58,6.67 32.38,6.86 32.38,7.62 | 32.38,7.62 31.62,7.62 31.43,7.43 31.43,6.86 31.24,6.67 30.93,6.67 | LED170.GND 34.74,6.67 | 34.74,6.67 34.48,6.67 34.29,6.86 34.29,7.62 | 34.29,7.62 33.53,7.62 33.34,7.43 33.34,6.86 33.15,6.67 32.84,6.67 | LED171.GND 36.65,6.67 | 36.65,6.67 36.39,6.67 36.2,6.86 36.2,7.62 | 36.2,7.62 35.43,7.62 35.24,7.43 35.24,6.86 35.05,6.67 34.74,6.67
  Top 0.152: LED172.GND 38.55,6.67 | 38.55,6.67 38.29,6.67 38.1,6.86 38.1,7.62 | 38.1,7.62 37.34,7.62 37.15,7.43 37.15,6.86 36.96,6.67 36.65,6.67 | LED173.GND 40.45,6.67 | 40.45,6.67 40.2,6.67 40.01,6.86 40.01,7.62 | 40.01,7.62 39.24,7.62 39.05,7.43 39.05,6.86 38.86,6.67 38.55,6.67 | LED174.GND 42.36,6.67 | 42.36,6.67 42.1,6.67 41.91,6.86 41.91,7.62 | 41.91,7.62 41.15,7.62 40.96,7.43 40.96,6.86 40.77,6.67 40.45,6.67 | LED175.GND 44.27,6.67 | 44.27,6.67 44.01,6.67 43.81,6.86 43.81,7.62 | 43.81,7.62 43.05,7.62 42.86,7.43 42.86,6.86 42.67,6.67 42.36,6.67 | LED176.GND 46.17,6.67 45.91,6.67 45.72,6.86 45.72,7.62 | 45.72,7.62 44.96,7.62 44.77,7.43 44.77,6.86 44.58,6.67 44.27,6.67 | LED154.GND 45.8,8.07 45.72,7.99 45.72,7.62 | LED153.GND 43.89,8.07 43.81,7.99 43.81,7.62 | LED152.GND 41.99,8.07 41.91,7.99 41.91,7.62 | LED151.GND 40.08,8.07 40.01,7.99 40.01,7.62 | LED150.GND 38.18,8.07 38.1,7.99 38.1,7.62 | LED149.GND 36.27,8.07 36.2,7.99 36.2,7.62 | LED148.GND 34.37,8.07 34.29,7.99 34.29,7.62 | LED147.GND 32.46,8.07 32.38,7.99 32.38,7.62 | LED146.GND 30.56,8.07 30.48,7.99 30.48,7.62 | LED145.GND 28.65,8.07 28.57,7.99 28.57,7.62 | LED144.GND 26.75,8.07 26.67,7.99 26.67,7.62 | LED143.GND 24.84,8.07 24.77,7.99 24.77,7.62 | LED142.GND 22.94,8.07 22.86,7.99 22.86,7.62 | LED141.GND 21.03,8.07 20.95,7.99 20.95,7.62 | LED140.GND 19.13,8.07 19.05,7.99 19.05,7.62 | LED139.GND 17.22,8.07 17.14,7.99 17.14,7.62 | LED138.GND 15.32,8.07 15.24,7.99 15.24,7.62 | LED137.GND 13.41,8.07 13.34,7.99 13.34,7.62 | LED136.GND 11.51,8.07 11.43,7.99 11.43,7.62 | 9.53,7.62 9.53,7.99 9.6,8.07 LED135.GND | 7.62,7.62 7.62,7.99 7.7,8.07 LED134.GND
  Top 0.152: LED177.GND 5.79,4.26 5.71,4.18 5.71,3.05 5.91,2.86 6.48,2.86 6.67,3.05 6.67,3.62 6.86,3.81 7.62,3.81 | 7.62,3.81 7.62,3.05 7.81,2.86 8.38,2.86 8.57,3.05 8.57,3.62 8.76,3.81 9.53,3.81 | 9.53,3.81 9.53,3.05 9.72,2.86 10.29,2.86 10.48,3.05 10.48,3.62 10.67,3.81 11.43,3.81 | 11.43,3.81 11.43,3.05 11.56,2.92 12.26,2.92 12.38,3.05 12.38,3.62 12.57,3.81 13.34,3.81 | 13.34,3.81 13.34,3.05 13.46,2.92 14.16,2.92 14.29,3.05 14.29,3.62 14.48,3.81 15.24,3.81 | 15.24,3.81 15.24,3.05 15.43,2.86 16,2.86 16.19,3.05 16.19,3.62 16.38,3.81 17.14,3.81 | 17.14,3.81 17.14,3.05 17.34,2.86 17.91,2.86 18.1,3.05 18.1,3.62 18.29,3.81 19.05,3.81 | 19.05,3.81 19.05,3.05 19.24,2.86 19.81,2.86 20,3.05 20,3.62 20.19,3.81 20.95,3.81 | 20.95,3.81 20.95,3.05 21.14,2.86 21.72,2.86 21.91,3.05 21.91,3.62 22.1,3.81 22.86,3.81 | 22.86,3.81 22.86,3.05 23.05,2.86 23.62,2.86 23.81,3.05 23.81,3.62 24,3.81 24.77,3.81 | 24.77,3.81 24.77,3.05 24.96,2.86 25.53,2.86 25.72,3.05 25.72,3.62 25.91,3.81 26.67,3.81 | 26.67,3.81 26.67,3.05 26.86,2.86 27.43,2.86 27.62,3.05 27.62,3.62 27.81,3.81 28.57,3.81 | 28.57,3.81 28.57,3.05 28.77,2.86 29.34,2.86 29.53,3.05 29.53,3.62 29.72,3.81 30.48,3.81 | 30.48,3.81 30.48,3.05 30.67,2.86 31.24,2.86 31.43,3.05 31.43,3.62 31.62,3.81 32.38,3.81 | 32.38,3.81 32.38,3.05 32.58,2.86 33.15,2.86 33.34,3.05 33.34,3.62 33.53,3.81 34.29,3.81 | 34.29,3.81 34.29,3.05 34.48,2.86 35.05,2.86 35.24,3.05 35.24,3.62 35.43,3.81 36.2,3.81 | 36.2,3.81 36.2,3.05 36.39,2.86 36.96,2.86 37.15,3.05 37.15,3.62 37.34,3.81 38.1,3.81 | 38.1,3.81 38.1,3.05 38.29,2.86 38.86,2.86 39.05,3.05 39.05,3.62 39.24,3.81 40.01,3.81
  Top 0.152: 40.01,3.81 40.01,3.05 40.2,2.86 40.77,2.86 40.96,3.05 40.96,3.62 41.15,3.81 41.91,3.81 | 41.91,3.81 41.91,3.05 42.1,2.86 42.67,2.86 42.86,3.05 42.86,3.62 43.05,3.81 43.81,3.81 | 43.81,3.81 43.81,3.05 44.01,2.86 44.58,2.86 44.77,3.05 44.77,3.62 44.96,3.81 45.61,3.81 45.72,3.92 45.72,4.25 46.61,4.25 46.61,3.81 | LED198.GND 45.8,4.26 | LED197.GND 43.89,4.26 43.81,4.18 43.81,3.81 | LED196.GND 41.99,4.26 41.91,4.18 41.91,3.81 | LED195.GND 40.08,4.26 40.01,4.18 40.01,3.81 | LED194.GND 38.18,4.26 38.1,4.18 38.1,3.81 | LED193.GND 36.27,4.26 36.2,4.18 36.2,3.81 | LED192.GND 34.37,4.26 34.29,4.18 34.29,3.81 | LED191.GND 32.46,4.26 32.38,4.18 32.38,3.81 | LED190.GND 30.56,4.26 30.48,4.18 30.48,3.81 | LED189.GND 28.65,4.26 28.57,4.18 28.57,3.81 | LED188.GND 26.75,4.26 26.67,4.18 26.67,3.81 | LED187.GND 24.84,4.26 24.77,4.18 24.77,3.81 | LED186.GND 22.94,4.26 22.86,4.18 22.86,3.81 | LED185.GND 21.03,4.26 20.95,4.18 20.95,3.81 | LED184.GND 19.13,4.26 19.05,4.18 19.05,3.81 | LED183.GND 17.22,4.26 17.14,4.18 17.14,3.81 | LED182.GND 15.32,4.26 15.24,4.18 15.24,3.81 | LED181.GND 13.41,4.26 13.34,4.18 | LED180.GND 11.51,4.26 11.43,4.18 11.43,3.81 | 9.53,3.81 9.53,4.18 9.6,4.26 LED179.GND | 7.62,3.81 7.62,4.18 7.7,4.26 LED178.GND | 5.71,11.43 4.95,11.43 4.7,11.68 v4.7,12.38 | 5.71,7.62 4.83,7.62 | 13.34,3.81 13.4,3.81 | 46.67,16.13 46.7,16.15 48.04,16.15 v48.07,16.13 | 13.34,3.81 13.34,4.19 13.4,4.25
  other vias: 4.7,8.57 5.71,2.73 0.57,4.38 1.4,12.26 22.73,20.26 21.78,20.26 22.86,21.02 22.86,22.35 48.2,14.54 48.9,14.54 47.69,17.59 46.99,12.83 46.99,12.19 46.99,11.56 49.85,12.57 49.85,10.41 46.99,10.03 49.85,8.45 49.85,7.81 49.66,5.14 4.7,1.14 5.02,0.51 4.25,0.51 0.51,7.62
  pour Top (isolate 0.15, rank 6): -3.17,26.67 55.24,26.67 56.07,-8.83 -2.35,-8.83
  pour Bottom (isolate 0.15): 0,22.86 0.06,-1.71 52.13,-5.02 50.8,22.86
N$1
  Top 0.152: LED43.DIN 43.37,17.22 43.29,17.14 43.05,17.14 42.86,16.95 42.86,16.7 LED42.DOUT
N$2
  Top 0.152: LED44.DIN 45.27,17.22 45.19,17.14 44.96,17.14 44.77,16.95 44.77,16.77 44.69,16.7 LED43.DOUT
N$3
  Bottom 0.406: MS1.25 SJ1.1
N$4
  Bottom 0.406: MS1.15 SJ20.2
N$5
  Bottom 0.406: MS1.24 SJ2.1
N$6
  Bottom 0.406: MS1.14 SJ19.2
N$7
  Bottom 0.406: MS1.13 SJ18.2
N$8
  Bottom 0.406: MS1.12 SJ17.2
N$9
  Bottom 0.406: MS1.11 SJ16.2
N$10
  Bottom 0.406: MS1.10 SJ15.2
N$11
  Bottom 0.406: MS1.9 SJ14.2
N$12
  Bottom 0.406: MS1.8 SJ13.2
N$13
  Bottom 0.406: MS1.7 SJ12.2
N$14
  Bottom 0.406: MS1.6 SJ11.2
N$15
  Bottom 0.406: MS1.5 SJ10.2
N$16
  Top 0.152: LED14.DOUT 30.93,18.97 31.01,19.05 31.25,19.05 31.43,19.23 31.43,19.42 31.51,19.5 LED15.DIN
N$17
  Top 0.152: LED45.DOUT 6.17,15.16 6.24,15.24 6.48,15.24 6.67,15.43 6.67,15.61 6.74,15.69 LED46.DIN
N$18  (via drill 0.25, 0.25 pad 0.51)
  Top 0.152: SW1.B 48.26,9.42 v48.26,10.92 48.26,13.44 SW1.B' | v1.27,4.95 1.52,4.7 3.43,4.7 4.76,3.37 4.76,2.41 5.91,1.27 MS1.1
  Bottom 0.152: v48.26,10.92 48.26,9.78 45.78,7.3 3.56,7.3 3.17,7.68 1.59,7.68 0.95,7.05 0.95,5.27 v1.27,4.95
N$19
  Bottom 0.406: MS1.23 SJ3.1
N$20
  Bottom 0.406: MS1.22 SJ4.1
N$21
  Bottom 0.406: MS1.21 SJ5.1
N$22  (via drill 0.25 pad 0.51)
  Top 0.152: LED198.DOUT 46.17,2.8 v45.91,2.54
  Bottom 0.152: v45.91,2.54 45.91,2.92 48.26,5.27 JP2.1
N$23
  Bottom 0.406: MS1.19 SJ7.1
N$24
  Bottom 0.406: MS1.18 SJ8.1
N$25
  Bottom 0.406: MS1.17 SJ9.1
N$26
  Top 0.152: LED46.DOUT 8.07,15.16 8.15,15.24 8.38,15.24 8.57,15.43 8.57,15.61 8.65,15.69 LED47.DIN
N$27
  Top 0.152: LED47.DOUT 9.97,15.16 10.05,15.24 10.29,15.24 10.48,15.43 10.48,15.61 10.55,15.69 LED48.DIN
N$28
  Top 0.152: LED48.DOUT 11.88,15.16 11.96,15.24 12.19,15.24 12.38,15.43 12.38,15.61 12.46,15.69 LED49.DIN
N$29
  Top 0.152: LED49.DOUT 13.79,15.16 13.86,15.24 14.1,15.24 14.29,15.43 14.29,15.61 14.36,15.69 LED50.DIN
N$30
  Top 0.152: LED50.DOUT 15.69,15.16 15.77,15.24 16,15.24 16.19,15.43 16.19,15.61 16.27,15.69 LED51.DIN
N$31
  Top 0.152: LED51.DOUT 17.59,15.16 17.67,15.24 17.91,15.24 18.1,15.43 18.1,15.61 18.17,15.69 LED52.DIN
N$32
  Top 0.152: LED52.DOUT 19.5,15.16 19.58,15.24 19.81,15.24 20,15.43 20,15.61 20.08,15.69 LED53.DIN
N$33
  Top 0.152: LED54.DOUT 23.31,15.16 23.39,15.24 23.62,15.24 23.81,15.43 23.81,15.61 23.89,15.69 LED55.DIN
N$34
  Top 0.152: LED53.DOUT 21.41,15.16 21.48,15.24 21.72,15.24 21.91,15.43 21.91,15.61 21.98,15.69 LED54.DIN
N$35
  Top 0.152: LED55.DOUT 25.21,15.16 25.29,15.24 25.53,15.24 25.72,15.43 25.72,15.61 25.79,15.69 LED56.DIN
N$36
  Top 0.152: LED56.DOUT 27.12,15.16 27.2,15.24 27.43,15.24 27.62,15.43 27.62,15.61 27.7,15.69 LED57.DIN
N$37
  Top 0.152: LED59.DOUT 32.84,15.16 32.91,15.24 33.15,15.24 33.34,15.43 33.34,15.61 33.41,15.69 LED60.DIN
N$38
  Top 0.152: LED60.DOUT 34.74,15.16 34.82,15.24 35.05,15.24 35.24,15.43 35.24,15.61 35.32,15.69 LED61.DIN
N$39
  Top 0.152: LED61.DOUT 36.65,15.16 36.72,15.24 36.96,15.24 37.15,15.43 37.15,15.61 37.22,15.69 LED62.DIN
N$40
  Top 0.152: LED62.DOUT 38.55,15.16 38.63,15.24 38.86,15.24 39.05,15.43 39.05,15.61 39.13,15.69 LED63.DIN
N$41
  Top 0.152: LED63.DOUT 40.45,15.16 40.53,15.24 40.77,15.24 40.96,15.43 40.96,15.69 LED64.DIN
N$42
  Top 0.152: LED64.DOUT 42.36,15.16 42.44,15.24 42.67,15.24 42.86,15.43 42.86,15.61 42.94,15.69 LED65.DIN
N$43
  Top 0.152: LED65.DOUT 44.27,15.16 44.34,15.24 44.58,15.24 44.77,15.43 44.77,15.61 44.84,15.69 LED66.DIN
N$44  (via drill 0.25 pad 0.51)
  Top 0.152: LED66.DOUT 46.61,14.79 46.8,14.61 v46.8,14.35 | LED67.DIN 4.83,13.79 4.7,13.91 4.7,14.54 v4.51,14.73
  Bottom 0.152: v46.8,14.35 4.89,14.35 v4.51,14.73
N$45
  Top 0.152: LED69.DIN 9.07,13.41 9,13.34 8.76,13.34 8.57,13.14 8.57,12.96 8.5,12.88 LED68.DOUT
N$46
  Top 0.152: LED67.DOUT 6.59,12.88 6.67,12.96 6.67,13.14 6.86,13.34 7.09,13.34 7.17,13.41 LED68.DIN
N$47
  Top 0.152: LED70.DIN 10.98,13.41 10.9,13.34 10.67,13.34 10.48,13.14 10.48,12.96 10.4,12.88 LED69.DOUT
N$48
  Top 0.152: LED71.DIN 12.88,13.41 12.81,13.34 12.57,13.34 12.38,13.14 12.38,12.96 12.31,12.88 LED70.DOUT
N$49
  Top 0.152: LED74.DIN 18.6,13.34 18.29,13.34 18.1,13.14 18.1,12.96 18.02,12.88 LED73.DOUT
N$50
  Top 0.152: LED75.DIN 20.5,13.41 20.43,13.34 20.19,13.34 20,13.14 20,12.96 19.93,12.88 LED74.DOUT
N$51
  Top 0.152: LED76.DIN 22.41,13.41 22.33,13.34 22.1,13.34 21.91,13.14 21.91,12.96 21.83,12.88 LED75.DOUT
N$52
  Top 0.152: LED77.DIN 24.32,13.41 24.24,13.34 24,13.34 23.81,13.14 23.81,12.96 23.74,12.88 LED76.DOUT
N$53
  Top 0.152: LED78.DIN 26.22,13.41 26.14,13.34 25.91,13.34 25.72,13.14 25.72,12.96 25.64,12.88 LED77.DOUT
N$54
  Top 0.152: LED1.DOUT 6.17,18.97 6.24,19.05 6.48,19.05 6.67,19.24 6.67,19.42 6.74,19.5 LED2.DIN
N$55
  Top 0.152: LED2.DOUT 8.07,18.97 8.15,19.05 8.38,19.05 8.57,19.24 8.57,19.42 8.65,19.5 LED3.DIN
N$56
  Top 0.152: LED3.DOUT 9.97,18.97 10.05,19.05 10.29,19.05 10.48,19.24 10.48,19.42 10.55,19.5 LED4.DIN
N$57
  Top 0.152: LED4.DOUT 11.88,18.97 11.96,19.05 12.19,19.05 12.38,19.24 12.38,19.42 12.46,19.5 LED5.DIN
N$58
  Top 0.152: LED5.DOUT 13.79,18.97 13.86,19.05 14.1,19.05 14.29,19.24 14.29,19.42 14.36,19.5 LED6.DIN
N$59
  Top 0.152: LED6.DOUT 15.69,18.97 15.77,19.05 16,19.05 16.19,19.24 16.19,19.42 16.27,19.5 LED7.DIN
N$60
  Top 0.152: LED7.DOUT 17.59,18.97 17.67,19.05 17.91,19.05 18.1,19.24 18.1,19.42 18.17,19.5 LED8.DIN
N$61
  Top 0.152: LED8.DOUT 19.5,18.97 19.58,19.05 19.81,19.05 20,19.24 20,19.42 20.08,19.5 LED9.DIN
N$62
  Top 0.152: LED10.DOUT 23.31,18.97 23.39,19.05 23.62,19.05 23.81,19.24 23.81,19.42 23.89,19.5 LED11.DIN
N$63
  Top 0.152: LED9.DOUT 21.41,18.97 21.48,19.05 21.72,19.05 21.91,19.24 21.91,19.42 21.98,19.5 LED10.DIN
N$64
  Top 0.152: LED11.DOUT 25.21,18.97 25.29,19.05 25.53,19.05 25.72,19.24 25.72,19.42 25.79,19.5 LED12.DIN
N$65
  Top 0.152: LED12.DOUT 27.12,18.97 27.2,19.05 27.43,19.05 27.62,19.24 27.62,19.42 27.7,19.5 LED13.DIN
N$66
  Top 0.152: LED15.DOUT 32.84,18.97 32.91,19.05 33.15,19.05 33.34,19.24 33.34,19.42 33.41,19.5 LED16.DIN
N$67
  Top 0.152: LED16.DOUT 34.74,18.97 34.82,19.05 35.05,19.05 35.24,19.24 35.24,19.42 35.32,19.5 LED17.DIN
N$68
  Top 0.152: LED17.DOUT 36.65,18.97 36.72,19.05 36.96,19.05 37.15,19.24 37.15,19.42 37.22,19.5 LED18.DIN
N$69
  Top 0.152: LED18.DOUT 38.55,18.97 38.63,19.05 38.86,19.05 39.05,19.24 39.05,19.42 39.13,19.5 LED19.DIN
N$71
  Top 0.152: LED19.DOUT 40.45,18.97 40.53,19.05 40.77,19.05 40.96,19.24 40.96,19.5 LED20.DIN
N$72
  Top 0.152: LED20.DOUT 42.36,18.97 42.44,19.05 42.67,19.05 42.86,19.24 42.86,19.42 42.94,19.5 LED21.DIN
N$73
  Top 0.152: LED21.DOUT 44.27,18.97 44.34,19.05 44.58,19.05 44.77,19.24 44.77,19.42 44.84,19.5 LED22.DIN
N$74  (via drill 0.25 pad 0.51)
  Top 0.152: v4.45,17.65 4.5,17.59 LED23.DIN | v47.05,17.91 47.05,18.35 46.8,18.61 LED22.DOUT
  Bottom 0.152: v4.45,17.65 2.48,17.65 0.57,15.68 0.57,14.16 0.76,13.97 3.43,13.97 3.75,14.29 3.75,15.05 4.19,15.49 44.61,15.49 arc45 44.66,15.52 v47.05,17.91
N$75
  Top 0.152: LED25.DIN 9.07,17.22 9,17.14 8.76,17.14 8.57,16.95 8.57,16.77 8.5,16.7 LED24.DOUT
N$76
  Top 0.152: LED23.DOUT 6.59,16.7 6.67,16.77 6.67,16.95 6.86,17.14 7.09,17.14 7.17,17.22 LED24.DIN
N$77
  Top 0.152: LED26.DIN 10.98,17.22 10.9,17.14 10.67,17.14 10.48,16.95 10.48,16.77 10.4,16.7 LED25.DOUT
N$78
  Top 0.152: LED27.DIN 12.88,17.22 12.81,17.14 12.57,17.14 12.38,16.95 12.38,16.77 12.31,16.7 LED26.DOUT
N$79
  Top 0.152: LED30.DIN 18.6,17.14 18.29,17.14 18.1,16.95 18.1,16.77 18.02,16.7 LED29.DOUT
N$80
  Top 0.152: LED31.DIN 20.5,17.22 20.43,17.14 20.19,17.14 20,16.95 20,16.77 19.93,16.7 LED30.DOUT
N$81
  Top 0.152: LED32.DIN 22.41,17.22 22.33,17.14 22.1,17.14 21.91,16.95 21.91,16.77 21.83,16.7 LED31.DOUT
N$82
  Top 0.152: LED33.DIN 24.32,17.22 24.24,17.14 24,17.14 23.81,16.95 23.81,16.77 23.74,16.7 LED32.DOUT
N$83
  Top 0.152: LED34.DIN 26.22,17.22 26.14,17.14 25.91,17.14 25.72,16.95 25.72,16.77 25.64,16.7 LED33.DOUT
N$84
  Top 0.152: LED35.DIN 28.12,17.22 28.05,17.14 27.81,17.14 27.62,16.95 27.62,16.77 27.55,16.7 LED34.DOUT
N$85
  Top 0.152: LED36.DIN 30.03,17.22 29.95,17.14 29.72,17.14 29.53,16.95 29.53,16.77 29.45,16.7 LED35.DOUT
N$86
  Top 0.152: LED37.DIN 31.93,17.22 31.86,17.14 31.62,17.14 31.43,16.95 31.43,16.77 31.36,16.7 LED36.DOUT
N$87
  Top 0.152: LED39.DIN 35.74,17.22 35.67,17.14 35.43,17.14 35.24,16.95 35.24,16.77 35.17,16.7 LED38.DOUT
N$88
  Top 0.152: LED38.DIN 33.84,17.22 33.76,17.14 33.53,17.14 33.34,16.95 33.34,16.77 33.26,16.7 LED37.DOUT
N$89
  Top 0.152: LED40.DIN 37.65,17.22 37.57,17.14 37.34,17.14 37.15,16.95 37.15,16.77 37.07,16.7 LED39.DOUT
N$90
  Top 0.152: LED41.DIN 39.55,17.22 39.48,17.14 39.24,17.14 39.05,16.95 39.05,16.77 38.98,16.7 LED40.DOUT
N$91
  Top 0.152: LED13.DOUT 29.02,18.97 29.1,19.05 29.34,19.05 29.53,19.24 29.53,19.42 29.6,19.5 LED14.DIN
N$92
  Top 0.152: LED28.DIN 14.79,17.22 14.71,17.14 14.48,17.14 14.29,16.95 14.29,16.77 14.21,16.7 LED27.DOUT
N$93
  Top 0.152: LED42.DIN 41.46,17.22 41.38,17.14 41.15,17.14 40.96,16.95 40.96,16.77 40.88,16.7 LED41.DOUT
N$94
  Top 0.152: LED79.DIN 28.12,13.41 28.05,13.34 27.81,13.34 27.62,13.14 27.62,12.96 27.55,12.88 LED78.DOUT
N$95
  Top 0.152: LED29.DIN 16.7,17.22 16.62,17.14 16.38,17.14 16.19,16.95 16.19,16.77 16.12,16.7 LED28.DOUT
N$96
  Top 0.152: LED80.DIN 30.03,13.41 29.95,13.34 29.72,13.34 29.53,13.14 29.53,12.96 29.45,12.88 LED79.DOUT
N$97
  Top 0.152: LED81.DIN 31.93,13.41 31.86,13.34 31.62,13.34 31.43,13.14 31.43,12.96 31.36,12.88 LED80.DOUT
N$98
  Top 0.152: LED83.DIN 35.74,13.41 35.67,13.34 35.43,13.34 35.24,13.14 35.24,12.96 35.17,12.88 LED82.DOUT
N$99
  Top 0.152: LED82.DIN 33.84,13.41 33.76,13.34 33.53,13.34 33.34,13.14 33.34,12.96 33.26,12.88 LED81.DOUT
N$100
  Top 0.152: LED84.DIN 37.65,13.41 37.57,13.34 37.34,13.34 37.15,13.14 37.15,12.96 37.07,12.88 LED83.DOUT
N$101
  Top 0.152: LED85.DIN 39.55,13.41 39.48,13.34 39.24,13.34 39.05,13.14 39.05,12.96 38.98,12.88 LED84.DOUT
N$102
  Top 0.152: LED57.DOUT 29.02,15.16 29.1,15.24 29.34,15.24 29.53,15.43 29.53,15.61 29.6,15.69 LED58.DIN
N$103
  Top 0.152: LED72.DIN 14.79,13.41 14.71,13.34 14.48,13.34 14.29,13.14 14.29,12.96 14.21,12.88 LED71.DOUT
N$104
  Top 0.152: LED86.DIN 41.46,13.41 41.38,13.34 41.15,13.34 40.96,13.14 40.96,12.96 40.88,12.88 LED85.DOUT
N$105
  Top 0.152: LED73.DIN 16.7,13.41 16.62,13.34 16.38,13.34 16.19,13.14 16.19,12.96 16.12,12.88 LED72.DOUT
N$106
  Top 0.152: LED87.DIN 43.37,13.41 43.29,13.34 43.05,13.34 42.86,13.14 42.86,12.88 LED86.DOUT
N$107
  Top 0.152: LED88.DIN 45.27,13.41 45.19,13.34 44.96,13.34 44.77,13.14 44.77,12.96 44.69,12.88 LED87.DOUT
N$108
  Top 0.152: LED58.DOUT 30.93,15.16 31.01,15.24 31.25,15.24 31.43,15.42 31.43,15.61 31.51,15.69 LED59.DIN
N$109
  Top 0.152: LED89.DOUT 6.17,11.35 6.24,11.43 6.48,11.43 6.67,11.62 6.67,11.8 6.74,11.88 LED90.DIN
N$110
  Top 0.152: LED90.DOUT 8.07,11.35 8.15,11.43 8.38,11.43 8.57,11.62 8.57,11.8 8.65,11.88 LED91.DIN
N$111
  Top 0.152: LED91.DOUT 9.97,11.35 10.05,11.43 10.29,11.43 10.48,11.62 10.48,11.8 10.55,11.88 LED92.DIN
N$112
  Top 0.152: LED92.DOUT 11.88,11.35 11.96,11.43 12.19,11.43 12.38,11.62 12.38,11.8 12.46,11.88 LED93.DIN
N$113
  Top 0.152: LED93.DOUT 13.79,11.35 13.86,11.43 14.1,11.43 14.29,11.62 14.29,11.8 14.36,11.88 LED94.DIN
N$114
  Top 0.152: LED94.DOUT 15.69,11.35 15.77,11.43 16,11.43 16.19,11.62 16.19,11.8 16.27,11.88 LED95.DIN
N$115
  Top 0.152: LED95.DOUT 17.59,11.35 17.67,11.43 17.91,11.43 18.1,11.62 18.1,11.8 18.17,11.88 LED96.DIN
N$116
  Top 0.152: LED96.DOUT 19.5,11.35 19.58,11.43 19.81,11.43 20,11.62 20,11.8 20.08,11.88 LED97.DIN
N$117
  Top 0.152: LED98.DOUT 23.31,11.35 23.39,11.43 23.62,11.43 23.81,11.62 23.81,11.8 23.89,11.88 LED99.DIN
N$118
  Top 0.152: LED97.DOUT 21.41,11.35 21.48,11.43 21.72,11.43 21.91,11.62 21.91,11.8 21.98,11.88 LED98.DIN
N$119
  Top 0.152: LED99.DOUT 25.21,11.35 25.29,11.43 25.53,11.43 25.72,11.62 25.72,11.8 25.79,11.88 LED100.DIN
N$120
  Top 0.152: LED100.DOUT 27.12,11.35 27.2,11.43 27.43,11.43 27.62,11.62 27.62,11.8 27.7,11.88 LED101.DIN
N$121
  Top 0.152: LED103.DOUT 32.84,11.35 32.91,11.43 33.15,11.43 33.34,11.62 33.34,11.8 33.41,11.88 LED104.DIN
N$122
  Top 0.152: LED104.DOUT 34.74,11.35 34.82,11.43 35.05,11.43 35.24,11.62 35.24,11.8 35.32,11.88 LED105.DIN
N$123
  Top 0.152: LED105.DOUT 36.65,11.35 36.72,11.43 36.96,11.43 37.15,11.62 37.15,11.8 37.22,11.88 LED106.DIN
N$124
  Top 0.152: LED106.DOUT 38.55,11.35 38.63,11.43 38.86,11.43 39.05,11.62 39.05,11.8 39.13,11.88 LED107.DIN
N$125
  Top 0.152: LED107.DOUT 40.45,11.35 40.53,11.43 40.77,11.43 40.96,11.62 40.96,11.88 LED108.DIN
N$126
  Top 0.152: LED108.DOUT 42.36,11.35 42.44,11.43 42.67,11.43 42.86,11.62 42.86,11.8 42.94,11.88 LED109.DIN
N$127
  Top 0.152: LED109.DOUT 44.27,11.35 44.34,11.43 44.58,11.43 44.77,11.62 44.77,11.8 44.84,11.88 LED110.DIN
N$128  (via drill 0.25 pad 0.51)
  Top 0.152: LED110.DOUT 46.68,10.98 v46.86,10.79 | LED111.DIN 4.82,9.97 4.7,10.1 4.7,10.67 4.57,10.79 v4.57,11.11
  Bottom 0.152: v4.57,11.11 46.55,11.11 v46.86,10.79
N$129
  Top 0.152: LED113.DIN 9.07,9.6 9,9.53 8.76,9.53 8.57,9.34 8.57,9.15 8.5,9.07 LED112.DOUT
N$130
  Top 0.152: LED111.DOUT 6.59,9.07 6.67,9.15 6.67,9.34 6.86,9.53 7.09,9.53 7.17,9.6 LED112.DIN
N$131
  Top 0.152: LED114.DIN 10.98,9.6 10.9,9.53 10.67,9.53 10.48,9.34 10.48,9.15 10.4,9.07 LED113.DOUT
N$132
  Top 0.152: LED115.DIN 12.88,9.6 12.81,9.53 12.57,9.53 12.38,9.34 12.38,9.15 12.31,9.07 LED114.DOUT
N$133
  Top 0.152: LED118.DIN 18.6,9.53 18.29,9.53 18.1,9.34 18.1,9.15 18.02,9.07 LED117.DOUT
N$134
  Top 0.152: LED119.DIN 20.5,9.6 20.43,9.53 20.19,9.53 20,9.34 20,9.15 19.93,9.07 LED118.DOUT
N$135
  Top 0.152: LED120.DIN 22.41,9.6 22.33,9.53 22.1,9.53 21.91,9.34 21.91,9.15 21.83,9.07 LED119.DOUT
N$136
  Top 0.152: LED121.DIN 24.32,9.6 24.24,9.53 24,9.53 23.81,9.34 23.81,9.15 23.74,9.07 LED120.DOUT
N$137
  Top 0.152: LED122.DIN 26.22,9.6 26.14,9.53 25.91,9.53 25.72,9.34 25.72,9.15 25.64,9.07 LED121.DOUT
N$138
  Top 0.152: LED123.DIN 28.12,9.6 28.05,9.53 27.81,9.53 27.62,9.34 27.62,9.15 27.55,9.07 LED122.DOUT
N$139
  Top 0.152: LED124.DIN 30.03,9.6 29.95,9.53 29.72,9.53 29.53,9.34 29.53,9.15 29.45,9.07 LED123.DOUT
N$140
  Top 0.152: LED125.DIN 31.93,9.6 31.86,9.53 31.62,9.53 31.43,9.34 31.43,9.15 31.36,9.07 LED124.DOUT
N$141
  Top 0.152: LED127.DIN 35.74,9.6 35.67,9.53 35.43,9.53 35.24,9.34 35.24,9.15 35.17,9.07 LED126.DOUT
N$142
  Top 0.152: LED126.DIN 33.84,9.6 33.76,9.53 33.53,9.53 33.34,9.34 33.34,9.15 33.26,9.07 LED125.DOUT
N$143
  Top 0.152: LED128.DIN 37.65,9.6 37.57,9.53 37.34,9.53 37.15,9.34 37.15,9.15 37.07,9.07 LED127.DOUT
N$144
  Top 0.152: LED129.DIN 39.55,9.6 39.48,9.53 39.24,9.53 39.05,9.34 39.05,9.15 38.98,9.07 LED128.DOUT
N$145
  Top 0.152: LED101.DOUT 29.02,11.35 29.1,11.43 29.34,11.43 29.53,11.62 29.53,11.8 29.6,11.88 LED102.DIN
N$146
  Top 0.152: LED116.DIN 14.79,9.6 14.71,9.53 14.48,9.53 14.29,9.34 14.29,9.15 14.21,9.07 LED115.DOUT
N$147
  Top 0.152: LED130.DIN 41.46,9.6 41.38,9.53 41.15,9.53 40.96,9.34 40.96,9.15 40.88,9.07 LED129.DOUT
N$148
  Top 0.152: LED117.DIN 16.7,9.6 16.62,9.53 16.38,9.53 16.19,9.34 16.19,9.15 16.12,9.07 LED116.DOUT
N$149
  Top 0.152: LED131.DIN 43.37,9.6 43.29,9.53 43.05,9.53 42.86,9.34 42.86,9.07 LED130.DOUT
N$150
  Top 0.152: LED132.DIN 45.27,9.6 45.19,9.53 44.96,9.53 44.77,9.34 44.77,9.15 44.69,9.07 LED131.DOUT
N$151
  Top 0.152: LED103.DIN 31.51,11.88 31.43,11.8 31.43,11.61 31.25,11.43 31.01,11.43 30.93,11.35 LED102.DOUT
N$152
  Top 0.152: LED133.DOUT 6.17,7.54 6.24,7.62 6.48,7.62 6.67,7.81 6.67,7.99 6.74,8.07 LED134.DIN
N$153